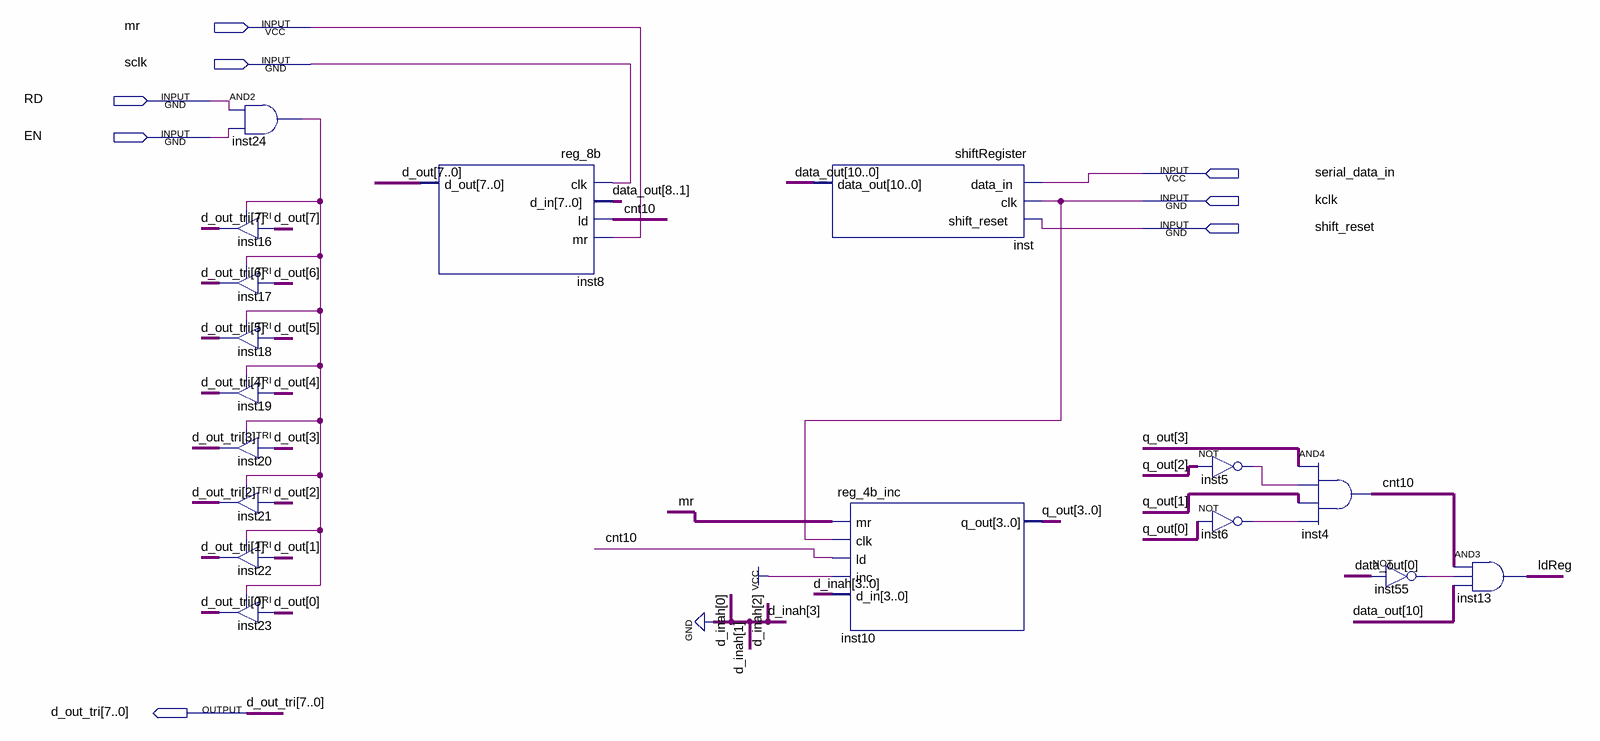
[diagram p0: schematic sheet]
// Quartus schematic ps2controller.bdf as structural Verilog: 17 symbols, 8 pins
module ps2controller (
  input  mr,
  input  sclk,
  input  RD,
  input  EN,
  input  serial_data_in,
  input  kclk,
  input  shift_reset,
  output [7:0] d_out_tri
);

  wire cnt10, inst5_out, inst6_out, inst24_out, inst55_out, ldReg;
  wire [3:0] q_out;
  wire [7:0] d_out;
  wire [10:0] data_out;

  and inst24 (inst24_out, RD, EN);
  TRI inst16 (.IN(d_out[7]), .OE(inst24_out), .OUT(d_out_tri[7]));
  TRI inst17 (.IN(d_out[6]), .OE(inst24_out), .OUT(d_out_tri[6]));
  TRI inst18 (.IN(d_out[5]), .OE(inst24_out), .OUT(d_out_tri[5]));
  TRI inst19 (.IN(d_out[4]), .OE(inst24_out), .OUT(d_out_tri[4]));
  TRI inst20 (.IN(d_out[3]), .OE(inst24_out), .OUT(d_out_tri[3]));
  TRI inst21 (.IN(d_out[2]), .OE(inst24_out), .OUT(d_out_tri[2]));
  TRI inst22 (.IN(d_out[1]), .OE(inst24_out), .OUT(d_out_tri[1]));
  TRI inst23 (.IN(d_out[0]), .OE(inst24_out), .OUT(d_out_tri[0]));
  reg_8b inst8 (.clk(sclk), .d_in(data_out[8:1]), .ld(cnt10), .mr(mr), .d_out(d_out));
  shiftRegister inst (.data_in(serial_data_in), .clk(kclk), .shift_reset(shift_reset), .data_out(data_out));
  reg_4b_inc inst10 (.mr(mr), .clk(kclk), .ld(cnt10), .inc(1'b1), .d_in(4'b0000), .q_out(q_out));
  not inst5 (inst5_out, q_out[2]);
  not inst6 (inst6_out, q_out[0]);
  and inst4 (cnt10, q_out[3], inst5_out, q_out[1], inst6_out);
  not inst55 (inst55_out, data_out[0]);
  and inst13 (ldReg, cnt10, inst55_out, data_out[10]);
endmodule
